# EAGLE schematic main (EAGLE 9.6.2)
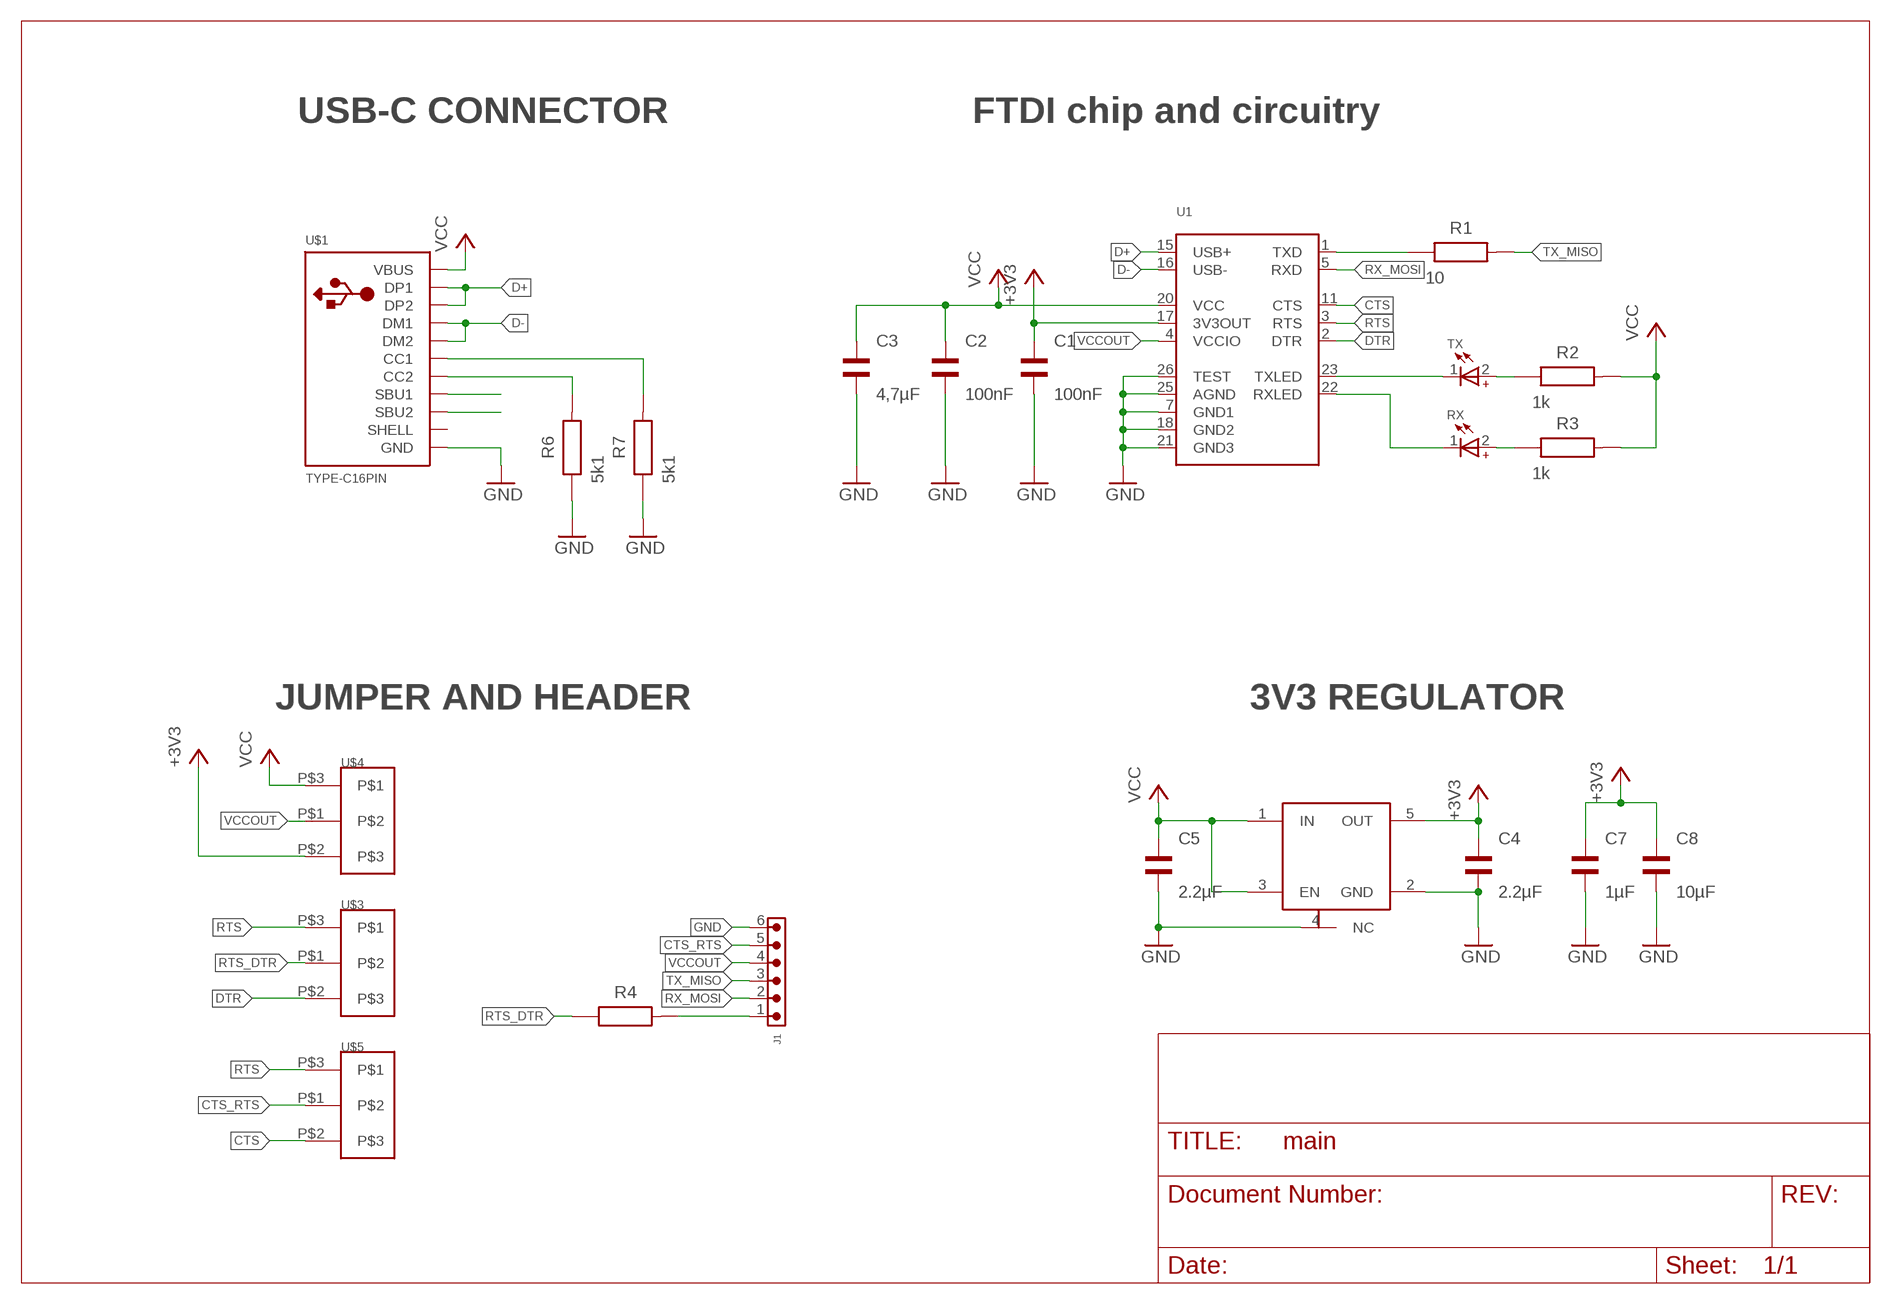
[diagram p0: schematic, sheet 1]

## Parts
C1  100nF  WCAP-CSGP_0603_885012206046_REFLOW  [WCAP-CSGP_0603_REFLOW]
C2  100nF  WCAP-CSGP_0603_885012206046_REFLOW  [WCAP-CSGP_0603_REFLOW]
C3  4,7µF  WCAP-CSGP_0603_885012106012_REFLOW  [WCAP-CSGP_0603_REFLOW]
C4  2.2µF  WCAP-CSGP_0603_885012206027_REFLOW  [WCAP-CSGP_0603_REFLOW]
C5  2.2µF  WCAP-CSGP_0603_885012206027_REFLOW  [WCAP-CSGP_0603_REFLOW]
C7  1µF  WCAP-CSGP_0603_885012206052_REFLOW  [WCAP-CSGP_0603_REFLOW]
C8  10µF  GRM188R61C106KAALD  [WCAP-CSGP_0603_REFLOW]
J1  6130XX11021_61300611021  [61300611021]
R1  10  WRIS-PSMB_0603_580060716001_1.6X0.8X0.35X0.6  [WRIS-PSMB_0603_1.6X0.8X0.35X0.6(LXWXHXPW)]
R2  1k  WRIS-PSMB_0603_580060716001_1.6X0.8X0.35X0.6  [WRIS-PSMB_0603_1.6X0.8X0.35X0.6(LXWXHXPW)]
R3  1k  WRIS-PSMB_0603_580060716001_1.6X0.8X0.35X0.6  [WRIS-PSMB_0603_1.6X0.8X0.35X0.6(LXWXHXPW)]
R4  10  WRIS-PSMB_0603_580060716001_1.6X0.8X0.35X0.6  [WRIS-PSMB_0603_1.6X0.8X0.35X0.6(LXWXHXPW)]
R6  5k1  WRIS-PSMB_0603_580060716001_1.6X0.8X0.35X0.6  [WRIS-PSMB_0603_1.6X0.8X0.35X0.6(LXWXHXPW)]
R7  5k1  WRIS-PSMB_0603_580060716001_1.6X0.8X0.35X0.6  [WRIS-PSMB_0603_1.6X0.8X0.35X0.6(LXWXHXPW)]
RX  WL-SMCW_0603_150060GS75000  [WL-SMCW_0603]
TX  WL-SMCW_0603_150060BS75000  [WL-SMCW_0603]
U1  FT232RLSSOP28  [SSOP28DB]
U$1  TYPE-C16PIN  [TYPE-C16PIN]
U$2  TLV75533PDBVRSOT-23-5  [DBV_R-PDSO-G5]
U$3  JUMPER1.27  [1.27_JUMPER]
U$4  JUMPER1.27  [1.27_JUMPER]
U$5  JUMPER1.27  [1.27_JUMPER]

## Nets
+3V3: C1.2 C4.2 C7.2 C8.2 U1.17(3V3OUT) U$2.5(OUT) U$4.P$2
CTS: U1.11(CTS) U$5.P$2
CTS_RTS: J1.5 U$5.P$1
D+: U1.15(USB+) U$1.A6(DP1) U$1.B6(DP2)
D-: U1.16(USB-) U$1.A7(DM1) U$1.B7(DM2)
DTR: U1.2(DTR) U$3.P$2
GND: C1.1 C2.1 C3.1 C4.1 C5.1 C7.1 C8.1 J1.6 R6.1 R7.1 U1.7(GND1) U1.18(GND2) U1.21(GND3) U1.25(AGND) U1.26(TEST) U$1.A1B12(GND) U$1.B1A12(GND) U$2.2(GND) U$2.4(NC)
N$1: R3.1 RX.2(+)
N$2: R2.1 TX.2(+)
N$9: J1.1 R4.2
N$11: R1.1 U1.1(TXD)
N$12: R7.2 U$1.A5(CC1)
N$13: R6.2 U$1.B5(CC2)
N$14: U$1.A8(SBU1)
N$15: U$1.B8(SBU2)
N$20: TX.1(-) U1.23(TXLED)
N$21: RX.1(-) U1.22(RXLED)
RTS: U1.3(RTS) U$3.P$3 U$5.P$3
RTS_DTR: R4.1 U$3.P$1
RX_MOSI: J1.2 U1.5(RXD)
TX_MISO: J1.3 R1.2
VCC: C2.2 C3.2 C5.2 R2.2 R3.2 U1.20(VCC) U$1.A4B9(VBUS) U$1.B4A9(VBUS) U$2.1(IN) U$2.3(EN) U$4.P$3
VCCOUT: J1.4 U1.4(VCCIO) U$4.P$1
Unconnected: U$1.SHELL1(SHELL) U$1.SHELL2(SHELL) U$1.SHELL3(SHELL) U$1.SHELL4(SHELL)

## Notes on the sheet
- USB-C CONNECTOR | FTDI chip and circuitry
- JUMPER AND HEADER | 3V3 REGULATOR

## Library data of the parts
C1-C5 C7 = 885012206052_Eagle_WCAP-CSGP_rev19b (1):WCAP-CSGP_0603: WCAP-CSGP Ceramic Capacitors Characteristics Multilayer Ceramic Chip Capacitor Recommended soldering:Reflow, for 0603 and 0805 wave soldering is also allowed Operating temperature:-55 °C to +125 °C; Ceramic characteristics: Class I - NPO ; Class II -X7R, X5R High performance ceramic High capacitance stability Minimal aging Termination:Cu/Ni/Sn <http://katalog.we-online.de/media/images/eisos/WCAP-CSGP_pf2.jpg> Details see: http://katalog.we-online.de/en/pbs/WCAP-CSGP-0603? Created: 2015-01-28 2015 (C) Wurth Elektronik
C8 = Eigene Bauteile:GRM188R61C106KAALD
J1 = 61300611821_Eagle_WR-PHD_rev19a:6130XX11021_61300611021: WR-PHD 2.54 mm THT Angled Pin Header ARTICLE PROPERTIES: Pins:2;​ 3;​ 4;​ 5;​ 6;​ 7;​ 8;​ 9;​ 10;​ 12;​ 14;​ 16;​ 18;​ 22;​ 32;​ 34;​ 36;​ 40 KIND PROPERTIES: Pitch：2.54 mm Quality Class:3 as per CECC 75 301-802 Rows：Single Gender：Pin Header Type：Angled MATERIAL PROPERTIES: Insulator Material :PA6T Insulator Flammability Rating:UL94 V-0 Contact Material:Copper Alloy Contact Plating:Gold Contact Type:Stamped GENERAL INFORMATION Operating Temperature:-40 up to +105 °C Compliance:Lead free / RoHS ELECTRICAL PROPERTIES: Rated Current:3 A IR 1:3 A Withstanding Voltage:500 V (AC) Contact Resistance:20 mΩ RISO:1000 MΩ CERTIFICATION UL Approval:E323964 PACKAGING PROPERTIES Packaging:Bag <https://katalog.we-online.com/media/images/v2/o33210v209%20Family_WR-PHD_6130xx11021.jpg> Details see: https://katalog.we-online.com/en/em/PHD_2_54_THT_ANGLED_PIN_HEADER_6130XX11021 Updated by Yingchun,Shan 2019-10-16 2019 (C) Würth Elektronik; DATASHEET-URL: https://katalog.we-online.com/em/datasheet/61300611021.pdf; GENDER: Pin Header; IR: 3A; MATES: WR-PHD 2.5mm Angled Socket Header/SMT Socket Header/Socket Header/Soket Header Bottom Entry; PACKAGING: Bag; PART-NUMBER: 61300611021; PINS: 6; ROWS: Single; TYPE: Angled
R1-R4 R6 R7 = 580060716001_Eagle_WRIS-PSMB_rev19a:WRIS-PSMB_0603: WRIS-PSMB Metal Plate Resistors Characteristics Metal plate resistors Recommended soldering: Reflow Operating temperature: -55 °C up to +155 °C Resistance range: 5 mΩ up to 10 mΩ Resistance tolerance: ±1 % Rated power: 0.33 W up to 1 W Enhanced current sensing Applications DMotor control Package name and Variant abbreviation: L X W X H X PW =Length X Width X Height X Pad Width <https://katalog.we-online.com/media/images/v2/o135743v209%20Family_WRIS-PSMB.jpg> Details see: https://katalog.we-online.com/en/pbs/WRIS-PSMB Created by Yingchun, Shan 2018-11-14 2018(C) Wurth Elektronik; DATASHEET-URL: https://katalog.we-online.de/pbs/datasheet/580060716001.pdf; IR: 8.12A; MOUNT: SMT; PART-NUMBER: 580060716001; PRATED: 0.33W; TCR: ±100ppm/ °C; TECHNICAL-REFERENCE: MB0603R005F103KAATP0000; VALUE: 5mOhm
RX = 150080BS75000_Eagle_WL-SMCW_rev20b:WL-SMCW_0603: WL-SMCW SMT Mono-color Chip LED Waterclea Characteristics Low energy consumption High reliability Low current requirement Fast switching No UV/IR radiation Smallest SMD LED package for exceptional brightness Top view LED Wide viewing angle Better solder ability Heat dissipation Applications Backlight for mobile and portable device keypads Indoor and outdoor message boards Flat backlight for LCDs, switches and symbols Display for industrial control systems and traffic Miniaturized color effects Pedestrian mark Optical indicators Tabular backlight: LCD, telephone key-press, power-switch, display board Indoor displays Signals Identifiers Backlight for automobile DVD LED General lighting Toys <https://www.we-online.com/catalog/media/o14904v209%20Family_WL-SMCW.jpg> Details see: https://www.we-online.com/catalog/en/WL-SMCW/ Updated BY Yingchun,Shan 2020-03-18 2020(C) Wurth Elektronik; ABSTRAHLWINKEL: 140°; CHIP-TECHNOLOGY: InGaN; DATASHEET-URL: https://www.we-online.com/catalog/datasheet/150060GS75000.pdf; EMITTING-COLOR: Green; I-V-TYP: 430mcd; LAMDA-DOM-TYP: 525nm; LAMDA-PEAK-TYP: 515nm; PART-NUMBER: 150060GS75000; V-F-TYP: 3.2V
TX = 150080BS75000_Eagle_WL-SMCW_rev20b:WL-SMCW_0603: WL-SMCW SMT Mono-color Chip LED Waterclea Characteristics Low energy consumption High reliability Low current requirement Fast switching No UV/IR radiation Smallest SMD LED package for exceptional brightness Top view LED Wide viewing angle Better solder ability Heat dissipation Applications Backlight for mobile and portable device keypads Indoor and outdoor message boards Flat backlight for LCDs, switches and symbols Display for industrial control systems and traffic Miniaturized color effects Pedestrian mark Optical indicators Tabular backlight: LCD, telephone key-press, power-switch, display board Indoor displays Signals Identifiers Backlight for automobile DVD LED General lighting Toys <https://www.we-online.com/catalog/media/o14904v209%20Family_WL-SMCW.jpg> Details see: https://www.we-online.com/catalog/en/WL-SMCW/ Updated BY Yingchun,Shan 2020-03-18 2020(C) Wurth Elektronik; ABSTRAHLWINKEL: 140°; CHIP-TECHNOLOGY: InGaN; DATASHEET-URL: https://www.we-online.com/catalog/datasheet/150060BS75000.pdf; EMITTING-COLOR: Blue; I-V-TYP: 145mcd; LAMDA-DOM-TYP: 470nm; LAMDA-PEAK-TYP: 465nm; PART-NUMBER: 150060BS75000; V-F-TYP: 3.2V
U1 = microbuilder:FT232RL: FTDI FT232RL USB TO RS232 Converter Digikey: 768-1007-1-ND
U$1 = Lib_A:TYPE-C16PIN
U$2 = Eigene Bauteile:TLV75533PDBVR
U$3-U$5 = Lib_A:JUMPER1.27